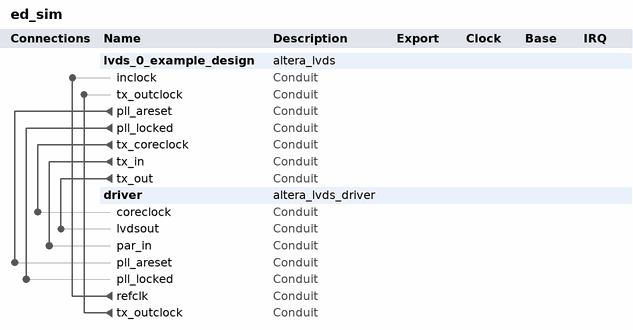
[diagram p0: system contents]
# Platform Designer (Qsys) system ed_sim, Cyclone 10 GX 10CX220YF780E5G
# Parameters at their usual value, and those the tool derives, are not listed.
package require -exact qsys 1.0
create_system ed_sim
set_project_property DEVICE_FAMILY {Cyclone 10 GX}
set_project_property DEVICE 10CX220YF780E5G

add_component lvds_0_example_design ip/ed_sim/ed_sim_lvds_0_example_design.ip altera_lvds lvds_0_example_design 19.5.0
load_component lvds_0_example_design
set_component_parameter_value MODE TX
set_component_parameter_value DUPLEX_MODE RX_Non-DPA
set_component_parameter_value USE_EXTERNAL_PLL false
set_component_parameter_value USE_CLOCK_PIN false
set_component_parameter_value NUM_CHANNELS 1
set_component_parameter_value NUM_CHANNELS_TX 1
set_component_parameter_value J_FACTOR 8
set_component_parameter_value DATA_RATE 1280.0
set_component_parameter_value INCLOCK_FREQUENCY 40.0
set_component_parameter_value REFCLK_FROM_CORE false
set_component_parameter_value ENABLE_MIGRATABLE_PORT_MAPPINGS false
set_component_parameter_value ENABLE_UFI_COUNTER_SIM 0
set_component_parameter_value REAL_MODE TX
set_component_parameter_value ACTUAL_INCLOCK_FREQUENCY 40.0
set_component_parameter_value PORT_MAP_FILE_NAME port_map_tx.csv
set_component_parameter_value RX_USE_BITSLIP false
set_component_parameter_value RX_INCLOCK_PHASE_SHIFT 0
set_component_parameter_value RX_RCCS_VAL 0.0
set_component_parameter_value RX_BITSLIP_USE_RESET false
set_component_parameter_value RX_BITSLIP_ASSERT_MAX false
set_component_parameter_value RX_DPA_USE_RESET false
set_component_parameter_value RX_DPA_LOSE_LOCK_ON_ONE_CHANGE false
set_component_parameter_value RX_DPA_ALIGN_TO_RISING_EDGE_ONLY false
set_component_parameter_value RX_DPA_USE_HOLD false
set_component_parameter_value ENABLE_DIV_RECONFIG false
set_component_parameter_value ENABLE_CPA_RECONFIG false
set_component_parameter_value RX_FIFO_USE_RESET false
set_component_parameter_value RX_CDR_SIMULATION_PPM_DRIFT 0
set_component_parameter_value RX_INCLOCK_PHASE_SHIFT_ACTUAL 0
set_component_parameter_value RX_DPA_LOCKED_USED false
set_component_parameter_value RX_BITSLIP_ROLLOVER 8
set_component_parameter_value TX_USE_OUTCLOCK true
set_component_parameter_value TX_OUTCLOCK_DIVISION 2
set_component_parameter_value TX_OUTCLOCK_PHASE_SHIFT 0
set_component_parameter_value TX_EXPORT_CORECLOCK true
set_component_parameter_value TX_REGISTER_CLOCK tx_coreclock
set_component_parameter_value TX_OUTCLOCK_PHASE_SHIFT_ACTUAL 0
set_component_parameter_value TX_OUTCLOCK_NON_STD_PHASE_SHIFT false
set_component_parameter_value PLL_CORECLOCK_RESOURCE Periphery
set_component_parameter_value PLL_USE_RESET true
set_component_parameter_value GENERATE_SDC_FILE true
set_component_parameter_value CPA_ENABLED false
set_component_parameter_value CPA_ENABLED_SHADOW false
set_component_parameter_value DUPLEX_ENABLED false
set_component_parameter_value PLL_EXPORT_LOCK true
set_component_parameter_value pll_fclk_frequency {1280.000000 MHz}
set_component_parameter_value pll_fclk_phase_shift {391 ps}
set_component_parameter_value pll_sclk_frequency {160.000000 MHz}
set_component_parameter_value pll_sclk_phase_shift {0 ps}
set_component_parameter_value pll_loaden_frequency {160.000000 MHz}
set_component_parameter_value pll_loaden_phase_shift {5467 ps}
set_component_parameter_value pll_loaden_duty_cycle 13
set_component_parameter_value pll_tx_outclock_frequency {640.000000 MHz}
set_component_parameter_value pll_tx_outclock_phase_shift {391 ps}
set_component_parameter_value pll_tx_outclock_fclk_frequency {1280.000000 MHz}
set_component_parameter_value pll_tx_outclock_fclk_phase_shift {391 ps}
set_component_parameter_value pll_tx_outclock_loaden_frequency {160.000000 MHz}
set_component_parameter_value pll_tx_outclock_loaden_phase_shift {5467 ps}
set_component_parameter_value pll_dprio_clk_frequency {40.000000 MHz}
set_component_parameter_value pll_vco_frequency {1280.000000 MHz}
set_component_parameter_value pll_inclock_frequency {40.0 MHz}
set_component_parameter_value PLL_SPEED_GRADE 5
set_component_parameter_value DERIVED_CPA_ENABLED false
set_component_parameter_value mapped_sys_info_device_family {Cyclone 10 GX}
set_component_parameter_value mapped_sys_info_device 10CX220YF780E5G
set_component_parameter_value mapped_sys_info_device_speedgrade 5
set_component_parameter_value mapped_reference_clock_frequency {40.0 MHz}
set_component_parameter_value mapped_vco_frequency {1280.0 MHz}
set_component_parameter_value mapped_external_pll_mode false
set_component_parameter_value gui_enable_advanced_mode 0
set_component_parameter_value gui_compensation_mode direct
set_component_parameter_value gui_number_of_pll_output_clocks 0
set_component_parameter_value gui_desired_outclk_frequency_0 1280.0
set_component_parameter_value gui_actual_outclk_frequency_0 1280.000000
set_component_parameter_value hp_actual_outclk_frequency_0 1280.0
set_component_parameter_value gui_outclk_phase_shift_unit_0 0
set_component_parameter_value gui_outclk_desired_phase_shift_0 391.0
set_component_parameter_value gui_outclk_actual_phase_shift_ps_0 391
set_component_parameter_value gui_outclk_actual_phase_shift_deg_0 180.2
set_component_parameter_value hp_outclk_actual_phase_shift_0 390.625
set_component_parameter_value gui_desired_outclk_duty_cycle_0 50.0
set_component_parameter_value gui_actual_outclk_duty_cycle_0 50
set_component_parameter_value hp_actual_outclk_duty_cycle_0 50.0
set_component_parameter_value gui_desired_outclk_frequency_1 160.0
set_component_parameter_value gui_actual_outclk_frequency_1 160.000000
set_component_parameter_value hp_actual_outclk_frequency_1 160.0
set_component_parameter_value gui_outclk_phase_shift_unit_1 0
set_component_parameter_value gui_outclk_desired_phase_shift_1 5467.0
set_component_parameter_value gui_outclk_actual_phase_shift_ps_1 5467
set_component_parameter_value gui_outclk_actual_phase_shift_deg_1 314.9
set_component_parameter_value hp_outclk_actual_phase_shift_1 5468.75
set_component_parameter_value gui_desired_outclk_duty_cycle_1 13.0
set_component_parameter_value gui_actual_outclk_duty_cycle_1 13
set_component_parameter_value hp_actual_outclk_duty_cycle_1 12.5
set_component_parameter_value gui_desired_outclk_frequency_2 160.0
set_component_parameter_value gui_actual_outclk_frequency_2 160.000000
set_component_parameter_value hp_actual_outclk_frequency_2 160.0
set_component_parameter_value gui_outclk_phase_shift_unit_2 0
set_component_parameter_value gui_outclk_desired_phase_shift_2 0.0
set_component_parameter_value gui_outclk_actual_phase_shift_ps_2 0
set_component_parameter_value gui_outclk_actual_phase_shift_deg_2 0.0
set_component_parameter_value hp_outclk_actual_phase_shift_2 0.0
set_component_parameter_value gui_desired_outclk_duty_cycle_2 50.0
set_component_parameter_value gui_actual_outclk_duty_cycle_2 50
set_component_parameter_value hp_actual_outclk_duty_cycle_2 50.0
set_component_parameter_value gui_desired_outclk_frequency_3 0.0
set_component_parameter_value gui_actual_outclk_frequency_3 N/A
set_component_parameter_value hp_actual_outclk_frequency_3 1280.0
set_component_parameter_value gui_outclk_phase_shift_unit_3 0
set_component_parameter_value gui_outclk_desired_phase_shift_3 0.0
set_component_parameter_value gui_outclk_actual_phase_shift_ps_3 N/A
set_component_parameter_value gui_outclk_actual_phase_shift_deg_3 N/A
set_component_parameter_value hp_outclk_actual_phase_shift_3 0.0
set_component_parameter_value gui_desired_outclk_duty_cycle_3 0.0
set_component_parameter_value gui_actual_outclk_duty_cycle_3 N/A
set_component_parameter_value hp_actual_outclk_duty_cycle_3 50.0
set_component_parameter_value gui_desired_outclk_frequency_4 0.0
set_component_parameter_value gui_actual_outclk_frequency_4 N/A
set_component_parameter_value hp_actual_outclk_frequency_4 1280.0
set_component_parameter_value gui_outclk_phase_shift_unit_4 0
set_component_parameter_value gui_outclk_desired_phase_shift_4 0.0
set_component_parameter_value gui_outclk_actual_phase_shift_ps_4 N/A
set_component_parameter_value gui_outclk_actual_phase_shift_deg_4 N/A
set_component_parameter_value hp_outclk_actual_phase_shift_4 0.0
set_component_parameter_value gui_desired_outclk_duty_cycle_4 0.0
set_component_parameter_value gui_actual_outclk_duty_cycle_4 N/A
set_component_parameter_value hp_actual_outclk_duty_cycle_4 50.0
set_component_parameter_value gui_desired_outclk_frequency_5 100.0
set_component_parameter_value gui_actual_outclk_frequency_5 100.0
set_component_parameter_value hp_actual_outclk_frequency_5 100.0
set_component_parameter_value gui_outclk_phase_shift_unit_5 0
set_component_parameter_value gui_outclk_desired_phase_shift_5 0.0
set_component_parameter_value gui_outclk_actual_phase_shift_ps_5 0.0
set_component_parameter_value gui_outclk_actual_phase_shift_deg_5 0.0
set_component_parameter_value hp_outclk_actual_phase_shift_5 0.0
set_component_parameter_value gui_desired_outclk_duty_cycle_5 50.0
set_component_parameter_value gui_actual_outclk_duty_cycle_5 50.0
set_component_parameter_value hp_actual_outclk_duty_cycle_5 50.0
set_component_parameter_value gui_desired_outclk_frequency_6 100.0
set_component_parameter_value gui_actual_outclk_frequency_6 100.0
set_component_parameter_value hp_actual_outclk_frequency_6 100.0
set_component_parameter_value gui_outclk_phase_shift_unit_6 0
set_component_parameter_value gui_outclk_desired_phase_shift_6 0.0
set_component_parameter_value gui_outclk_actual_phase_shift_ps_6 0.0
set_component_parameter_value gui_outclk_actual_phase_shift_deg_6 0.0
set_component_parameter_value hp_outclk_actual_phase_shift_6 0.0
set_component_parameter_value gui_desired_outclk_duty_cycle_6 50.0
set_component_parameter_value gui_actual_outclk_duty_cycle_6 50.0
set_component_parameter_value hp_actual_outclk_duty_cycle_6 50.0
set_component_parameter_value gui_desired_outclk_frequency_7 100.0
set_component_parameter_value gui_actual_outclk_frequency_7 100.0
set_component_parameter_value hp_actual_outclk_frequency_7 100.0
set_component_parameter_value gui_outclk_phase_shift_unit_7 0
set_component_parameter_value gui_outclk_desired_phase_shift_7 0.0
set_component_parameter_value gui_outclk_actual_phase_shift_ps_7 0.0
set_component_parameter_value gui_outclk_actual_phase_shift_deg_7 0.0
set_component_parameter_value hp_outclk_actual_phase_shift_7 0.0
set_component_parameter_value gui_desired_outclk_duty_cycle_7 50.0
set_component_parameter_value gui_actual_outclk_duty_cycle_7 50.0
set_component_parameter_value hp_actual_outclk_duty_cycle_7 50.0
set_component_parameter_value gui_desired_outclk_frequency_8 100.0
set_component_parameter_value gui_actual_outclk_frequency_8 100.0
set_component_parameter_value hp_actual_outclk_frequency_8 100.0
set_component_parameter_value gui_outclk_phase_shift_unit_8 0
set_component_parameter_value gui_outclk_desired_phase_shift_8 0.0
set_component_parameter_value gui_outclk_actual_phase_shift_ps_8 0.0
set_component_parameter_value gui_outclk_actual_phase_shift_deg_8 0.0
set_component_parameter_value hp_outclk_actual_phase_shift_8 0.0
set_component_parameter_value gui_desired_outclk_duty_cycle_8 50.0
set_component_parameter_value gui_actual_outclk_duty_cycle_8 50.0
set_component_parameter_value hp_actual_outclk_duty_cycle_8 50.0
save_component

add_component driver ip/ed_sim/ed_sim_driver.ip altera_lvds_driver driver 19.1
load_component driver
set_component_parameter_value MODE TX
set_component_parameter_value DUPLEX_MODE RX_Non-DPA
set_component_parameter_value USE_EXTERNAL_PLL false
set_component_parameter_value USE_CLOCK_PIN false
set_component_parameter_value NUM_CHANNELS 1
set_component_parameter_value NUM_CHANNELS_TX 1
set_component_parameter_value J_FACTOR 8
set_component_parameter_value DATA_RATE 1280.0
set_component_parameter_value INCLOCK_FREQUENCY 40.0
set_component_parameter_value REFCLK_FROM_CORE false
set_component_parameter_value ENABLE_MIGRATABLE_PORT_MAPPINGS false
set_component_parameter_value ENABLE_UFI_COUNTER_SIM 0
set_component_parameter_value REAL_MODE TX
set_component_parameter_value ACTUAL_INCLOCK_FREQUENCY 40.0
set_component_parameter_value PORT_MAP_FILE_NAME port_map_tx.csv
set_component_parameter_value RX_USE_BITSLIP false
set_component_parameter_value RX_INCLOCK_PHASE_SHIFT 0
set_component_parameter_value RX_RCCS_VAL 0.0
set_component_parameter_value RX_BITSLIP_USE_RESET false
set_component_parameter_value RX_BITSLIP_ASSERT_MAX false
set_component_parameter_value RX_DPA_USE_RESET false
set_component_parameter_value RX_DPA_LOSE_LOCK_ON_ONE_CHANGE false
set_component_parameter_value RX_DPA_ALIGN_TO_RISING_EDGE_ONLY false
set_component_parameter_value RX_DPA_USE_HOLD false
set_component_parameter_value ENABLE_DIV_RECONFIG false
set_component_parameter_value ENABLE_CPA_RECONFIG false
set_component_parameter_value RX_FIFO_USE_RESET false
set_component_parameter_value RX_CDR_SIMULATION_PPM_DRIFT 0
set_component_parameter_value RX_INCLOCK_PHASE_SHIFT_ACTUAL 0
set_component_parameter_value RX_DPA_LOCKED_USED false
set_component_parameter_value RX_BITSLIP_ROLLOVER 8
set_component_parameter_value TX_USE_OUTCLOCK true
set_component_parameter_value TX_OUTCLOCK_DIVISION 2
set_component_parameter_value TX_OUTCLOCK_PHASE_SHIFT 0
set_component_parameter_value TX_EXPORT_CORECLOCK true
set_component_parameter_value TX_REGISTER_CLOCK tx_coreclock
set_component_parameter_value TX_OUTCLOCK_PHASE_SHIFT_ACTUAL 0
set_component_parameter_value TX_OUTCLOCK_NON_STD_PHASE_SHIFT false
set_component_parameter_value PLL_CORECLOCK_RESOURCE Periphery
set_component_parameter_value PLL_USE_RESET true
set_component_parameter_value GENERATE_SDC_FILE true
set_component_parameter_value CPA_ENABLED false
set_component_parameter_value CPA_ENABLED_SHADOW false
set_component_parameter_value DUPLEX_ENABLED false
set_component_parameter_value PLL_EXPORT_LOCK true
set_component_parameter_value pll_fclk_frequency {1280.000000 MHz}
set_component_parameter_value pll_fclk_phase_shift {391 ps}
set_component_parameter_value pll_sclk_frequency {160.000000 MHz}
set_component_parameter_value pll_sclk_phase_shift {0 ps}
set_component_parameter_value pll_loaden_frequency {160.000000 MHz}
set_component_parameter_value pll_loaden_phase_shift {5467 ps}
set_component_parameter_value pll_loaden_duty_cycle 13
set_component_parameter_value pll_tx_outclock_frequency {640.000000 MHz}
set_component_parameter_value pll_tx_outclock_phase_shift {391 ps}
set_component_parameter_value pll_tx_outclock_fclk_frequency {1280.000000 MHz}
set_component_parameter_value pll_tx_outclock_fclk_phase_shift {391 ps}
set_component_parameter_value pll_tx_outclock_loaden_frequency {160.000000 MHz}
set_component_parameter_value pll_tx_outclock_loaden_phase_shift {5467 ps}
set_component_parameter_value pll_dprio_clk_frequency {40.000000 MHz}
set_component_parameter_value pll_vco_frequency {1280.000000 MHz}
set_component_parameter_value pll_inclock_frequency {40.0 MHz}
set_component_parameter_value PLL_SPEED_GRADE 5
set_component_parameter_value DERIVED_CPA_ENABLED false
set_component_parameter_value mapped_sys_info_device_family {Cyclone 10 GX}
set_component_parameter_value mapped_sys_info_device 10CX220YF780E5G
set_component_parameter_value mapped_sys_info_device_speedgrade 5
set_component_parameter_value mapped_reference_clock_frequency {40.0 MHz}
set_component_parameter_value mapped_vco_frequency {1280.0 MHz}
set_component_parameter_value mapped_external_pll_mode false
set_component_parameter_value gui_enable_advanced_mode 0
set_component_parameter_value gui_compensation_mode direct
set_component_parameter_value gui_number_of_pll_output_clocks 0
set_component_parameter_value gui_desired_outclk_frequency_0 1280.0
set_component_parameter_value gui_actual_outclk_frequency_0 1280.000000
set_component_parameter_value hp_actual_outclk_frequency_0 1280.0
set_component_parameter_value gui_outclk_phase_shift_unit_0 0
set_component_parameter_value gui_outclk_desired_phase_shift_0 391.0
set_component_parameter_value gui_outclk_actual_phase_shift_ps_0 391
set_component_parameter_value gui_outclk_actual_phase_shift_deg_0 180.2
set_component_parameter_value hp_outclk_actual_phase_shift_0 390.625
set_component_parameter_value gui_desired_outclk_duty_cycle_0 50.0
set_component_parameter_value gui_actual_outclk_duty_cycle_0 50
set_component_parameter_value hp_actual_outclk_duty_cycle_0 50.0
set_component_parameter_value gui_desired_outclk_frequency_1 160.0
set_component_parameter_value gui_actual_outclk_frequency_1 160.000000
set_component_parameter_value hp_actual_outclk_frequency_1 160.0
set_component_parameter_value gui_outclk_phase_shift_unit_1 0
set_component_parameter_value gui_outclk_desired_phase_shift_1 5467.0
set_component_parameter_value gui_outclk_actual_phase_shift_ps_1 5467
set_component_parameter_value gui_outclk_actual_phase_shift_deg_1 314.9
set_component_parameter_value hp_outclk_actual_phase_shift_1 5468.75
set_component_parameter_value gui_desired_outclk_duty_cycle_1 13.0
set_component_parameter_value gui_actual_outclk_duty_cycle_1 13
set_component_parameter_value hp_actual_outclk_duty_cycle_1 12.5
set_component_parameter_value gui_desired_outclk_frequency_2 160.0
set_component_parameter_value gui_actual_outclk_frequency_2 160.000000
set_component_parameter_value hp_actual_outclk_frequency_2 160.0
set_component_parameter_value gui_outclk_phase_shift_unit_2 0
set_component_parameter_value gui_outclk_desired_phase_shift_2 0.0
set_component_parameter_value gui_outclk_actual_phase_shift_ps_2 0
set_component_parameter_value gui_outclk_actual_phase_shift_deg_2 0.0
set_component_parameter_value hp_outclk_actual_phase_shift_2 0.0
set_component_parameter_value gui_desired_outclk_duty_cycle_2 50.0
set_component_parameter_value gui_actual_outclk_duty_cycle_2 50
set_component_parameter_value hp_actual_outclk_duty_cycle_2 50.0
set_component_parameter_value gui_desired_outclk_frequency_3 0.0
set_component_parameter_value gui_actual_outclk_frequency_3 N/A
set_component_parameter_value hp_actual_outclk_frequency_3 1280.0
set_component_parameter_value gui_outclk_phase_shift_unit_3 0
set_component_parameter_value gui_outclk_desired_phase_shift_3 0.0
set_component_parameter_value gui_outclk_actual_phase_shift_ps_3 N/A
set_component_parameter_value gui_outclk_actual_phase_shift_deg_3 N/A
set_component_parameter_value hp_outclk_actual_phase_shift_3 0.0
set_component_parameter_value gui_desired_outclk_duty_cycle_3 0.0
set_component_parameter_value gui_actual_outclk_duty_cycle_3 N/A
set_component_parameter_value hp_actual_outclk_duty_cycle_3 50.0
set_component_parameter_value gui_desired_outclk_frequency_4 0.0
set_component_parameter_value gui_actual_outclk_frequency_4 N/A
set_component_parameter_value hp_actual_outclk_frequency_4 1280.0
set_component_parameter_value gui_outclk_phase_shift_unit_4 0
set_component_parameter_value gui_outclk_desired_phase_shift_4 0.0
set_component_parameter_value gui_outclk_actual_phase_shift_ps_4 N/A
set_component_parameter_value gui_outclk_actual_phase_shift_deg_4 N/A
set_component_parameter_value hp_outclk_actual_phase_shift_4 0.0
set_component_parameter_value gui_desired_outclk_duty_cycle_4 0.0
set_component_parameter_value gui_actual_outclk_duty_cycle_4 N/A
set_component_parameter_value hp_actual_outclk_duty_cycle_4 50.0
set_component_parameter_value gui_desired_outclk_frequency_5 100.0
set_component_parameter_value gui_actual_outclk_frequency_5 100.0
set_component_parameter_value hp_actual_outclk_frequency_5 100.0
set_component_parameter_value gui_outclk_phase_shift_unit_5 0
set_component_parameter_value gui_outclk_desired_phase_shift_5 0.0
set_component_parameter_value gui_outclk_actual_phase_shift_ps_5 0.0
set_component_parameter_value gui_outclk_actual_phase_shift_deg_5 0.0
set_component_parameter_value hp_outclk_actual_phase_shift_5 0.0
set_component_parameter_value gui_desired_outclk_duty_cycle_5 50.0
set_component_parameter_value gui_actual_outclk_duty_cycle_5 50.0
set_component_parameter_value hp_actual_outclk_duty_cycle_5 50.0
set_component_parameter_value gui_desired_outclk_frequency_6 100.0
set_component_parameter_value gui_actual_outclk_frequency_6 100.0
set_component_parameter_value hp_actual_outclk_frequency_6 100.0
set_component_parameter_value gui_outclk_phase_shift_unit_6 0
set_component_parameter_value gui_outclk_desired_phase_shift_6 0.0
set_component_parameter_value gui_outclk_actual_phase_shift_ps_6 0.0
set_component_parameter_value gui_outclk_actual_phase_shift_deg_6 0.0
set_component_parameter_value hp_outclk_actual_phase_shift_6 0.0
set_component_parameter_value gui_desired_outclk_duty_cycle_6 50.0
set_component_parameter_value gui_actual_outclk_duty_cycle_6 50.0
set_component_parameter_value hp_actual_outclk_duty_cycle_6 50.0
set_component_parameter_value gui_desired_outclk_frequency_7 100.0
set_component_parameter_value gui_actual_outclk_frequency_7 100.0
set_component_parameter_value hp_actual_outclk_frequency_7 100.0
set_component_parameter_value gui_outclk_phase_shift_unit_7 0
set_component_parameter_value gui_outclk_desired_phase_shift_7 0.0
set_component_parameter_value gui_outclk_actual_phase_shift_ps_7 0.0
set_component_parameter_value gui_outclk_actual_phase_shift_deg_7 0.0
set_component_parameter_value hp_outclk_actual_phase_shift_7 0.0
set_component_parameter_value gui_desired_outclk_duty_cycle_7 50.0
set_component_parameter_value gui_actual_outclk_duty_cycle_7 50.0
set_component_parameter_value hp_actual_outclk_duty_cycle_7 50.0
set_component_parameter_value gui_desired_outclk_frequency_8 100.0
set_component_parameter_value gui_actual_outclk_frequency_8 100.0
set_component_parameter_value hp_actual_outclk_frequency_8 100.0
set_component_parameter_value gui_outclk_phase_shift_unit_8 0
set_component_parameter_value gui_outclk_desired_phase_shift_8 0.0
set_component_parameter_value gui_outclk_actual_phase_shift_ps_8 0.0
set_component_parameter_value gui_outclk_actual_phase_shift_deg_8 0.0
set_component_parameter_value hp_outclk_actual_phase_shift_8 0.0
set_component_parameter_value gui_desired_outclk_duty_cycle_8 50.0
set_component_parameter_value gui_actual_outclk_duty_cycle_8 50.0
set_component_parameter_value hp_actual_outclk_duty_cycle_8 50.0
set_component_parameter_value VCO_DIV_EXPONENT 0
set_component_parameter_value VCO_FREQUENCY 0
set_component_parameter_value EXTERNAL_PLL false
set_component_parameter_value TX_OUTCLOCK_ENABLED true
set_component_parameter_value REFCLK_PERIOD 25000
set_component_parameter_value USE_DUPLEX false
set_component_parameter_value SERDES_DPA_MODE TX
set_component_parameter_value ALIGNER_WAIT_CYCLES 4
save_component

# connections
add_connection driver.refclk lvds_0_example_design.inclock conduit
add_connection driver.tx_outclock lvds_0_example_design.tx_outclock conduit
add_connection lvds_0_example_design.pll_areset driver.pll_areset conduit
add_connection lvds_0_example_design.pll_locked driver.pll_locked conduit
add_connection lvds_0_example_design.tx_coreclock driver.coreclock conduit
add_connection lvds_0_example_design.tx_in driver.par_in conduit
add_connection lvds_0_example_design.tx_out driver.lvdsout conduit

save_system ed_sim.qsys
